# Altium project ASBB.PrjPcb (part 2 of 2)

## Sheet ASBB_ServoIn.SchDoc
size A4
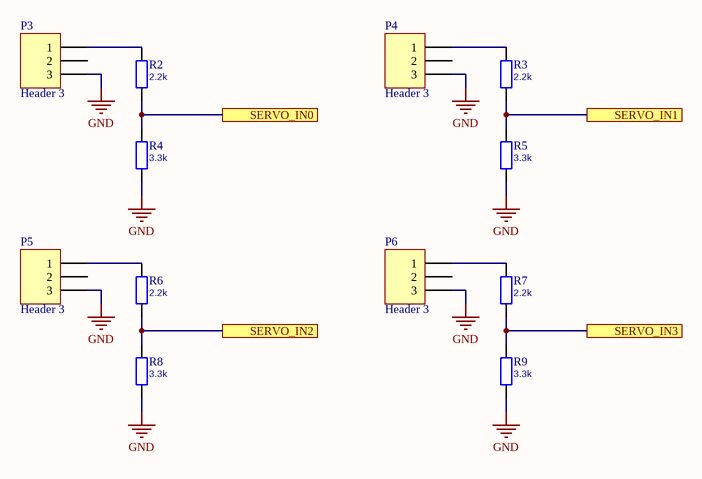
[diagram p18: ASBB_ServoIn.SchDoc]

### Parts
P3  Header 3  [HDR1X3]
P4  Header 3  [HDR1X3]
P5  Header 3  [HDR1X3]
P6  Header 3  [HDR1X3]
R2  2.2k  [0603]
R3  2.2k  [0603]
R4  3.3k  [0603]
R5  3.3k  [0603]
R6  2.2k  [0603]
R7  2.2k  [0603]
R8  3.3k  [0603]
R9  3.3k  [0603]

### Ports
SERVO_IN0, SERVO_IN1, SERVO_IN2, SERVO_IN3

### Nets
GND: P3.3 P4.3 P5.3 P6.3 R4.1 R5.1 R8.1 R9.1
NetIC601_1: R7.1 R9.2 ; port SERVO_IN3
NetIC601_27: R2.1 R4.2 ; port SERVO_IN0
NetIC601_28: R3.1 R5.2 ; port SERVO_IN1
NetIC601_29: R6.1 R8.2 ; port SERVO_IN2
NetP3_1: P3.1 R2.2
NetP4_1: P4.1 R3.2
NetP5_1: P5.1 R6.2
NetP6_1: P6.1 R7.2

Not connected (* = marked no-connect by the designer): P3 2; P4 2; P5 2; P6 2

### Library data of the parts
P3-P6 = Header 3: Header, 3-Pin; LatestRevisionDate: 17-Jul-2002; LatestRevisionNote: Re-released for DXP Platform.; Publisher: Altium Limited
R2-R9 = Resistor: Partnumber: ?; Value: ?

## Nets that join several sheets
3.3V: ASBB_5VBuck (5 pins), ASBB_USBUART (5 pins), ASBB_BMP388 (5 pins), ASBB_BNO055 (5 pins), ASBB_MCP25625 (P801.2 R801.2), ASBB_FireflyX1 (L501.1), ASBB_SX1278 (IC1301.8 IC1301.13), ASBB_GiantGecko (24 pins), ASBB_Servo (12 pins), ASBB_MightyGecko (6 pins), ASBB_Sonar (6 pins), ASBB_WheelSpeed (6 pins), ASBB_ADC (6 pins)
5V: ASBB_5VBuck (9 pins), ASBB_MAX98357 (7 pins), ASBB_MCP25625 (P801.1), ASBB_Servo (12 pins), ASBB_MightyGecko (IC901.37), ASBB_Sonar (6 pins)
GND: ASBB_VarBuck (12 pins), ASBB_5VBuck (18 pins), ASBB_USBUART (12 pins), ASBB_BMP388 (6 pins), ASBB_BNO055 (13 pins), ASBB_MAX98357 (11 pins), ASBB_MCP25625 (P801.8), ASBB_FireflyX1 (13 pins), ASBB_SX1278 (IC1301.1 P1301.6), ASBB_GiantGecko (33 pins), ASBB_Servo (6 pins), ASBB_MightyGecko (9 pins), ASBB_Sonar (6 pins), ASBB_WheelSpeed (P1701.3 P1702.3 P1703.3), ASBB_VIN (C1601.2 D1601.2 Q1601.3), ASBB_ADC (5 pins), ASBB_ServoIn (8 pins)
GG_US0_CLK: ASBB_SX1278 (IC1301.12 P1301.3), ASBB_GiantGecko (IC601.96)
GG_US0_RX: ASBB_SX1278 (IC1301.11 P1301.4), ASBB_GiantGecko (IC601.95)
GG_US0_TX: ASBB_SX1278 (IC1301.10 P1301.5), ASBB_GiantGecko (IC601.94)
HPC_CS0: ASBB_GiantGecko (IC601.15), ASBB_SPICrossbar (J1201.2 P1203.1)
HPC_CS1: ASBB_MightyGecko (IC901.48), ASBB_SPICrossbar (J1201.1 P1203.2)
HPC_MISO: ASBB_GiantGecko (IC601.12), ASBB_SPICrossbar (J1201.4 P1201.1 P1202.3)
HPC_MOSI: ASBB_GiantGecko (IC601.13), ASBB_SPICrossbar (J1201.3 P1201.3 P1202.1)
HPC_SCK: ASBB_GiantGecko (IC601.14), ASBB_MightyGecko (IC901.46), ASBB_SPICrossbar (J1201.5)
NetB501_13: ASBB_FireflyX1 (B501.13 P501.4), ASBB_GiantGecko (IC601.69)
NetB501_19: ASBB_FireflyX1 (B501.19 P501.1 R502.1), ASBB_GiantGecko (IC601.70)
NetC1404_2: ASBB_5VBuck (D201.2), ASBB_USBUART (C1404.2 C1405.2 J1401.1 U1401.19)
NetIC601_1: ASBB_GiantGecko (IC601.1), ASBB_ServoIn (R7.1 R9.2)
NetIC601_9: ASBB_GiantGecko (IC601.9), ASBB_WheelSpeed (P1701.2 R1701.1)
NetIC601_10: ASBB_GiantGecko (IC601.10), ASBB_WheelSpeed (P1702.2 R1702.1)
NetIC601_11: ASBB_GiantGecko (IC601.11), ASBB_WheelSpeed (P1703.2 R1703.1)
NetIC601_18: ASBB_MAX98357 (P701.2 U701.14), ASBB_GiantGecko (IC601.18)
NetIC601_19: ASBB_MAX98357 (P701.1 U701.1), ASBB_GiantGecko (IC601.19)
NetIC601_21: ASBB_MAX98357 (P701.3 U701.16), ASBB_GiantGecko (IC601.21)
NetIC601_22: ASBB_GiantGecko (IC601.22), ASBB_Sonar (R1109.1 R1112.2)
NetIC601_23: ASBB_GiantGecko (IC601.23), ASBB_Sonar (R1107.1 R1110.2)
NetIC601_26: ASBB_GiantGecko (IC601.26), ASBB_Sonar (R1108.1 R1111.2)
NetIC601_27: ASBB_GiantGecko (IC601.27), ASBB_ServoIn (R2.1 R4.2)
NetIC601_28: ASBB_GiantGecko (IC601.28), ASBB_ServoIn (R3.1 R5.2)
NetIC601_29: ASBB_GiantGecko (IC601.29), ASBB_ServoIn (R6.1 R8.2)
NetIC601_54: ASBB_BMP388 (U301.7), ASBB_GiantGecko (IC601.54)
NetIC601_61: ASBB_BNO055 (R403.2 U401.11), ASBB_GiantGecko (IC601.61)
NetIC601_64: ASBB_BMP388 (U301.4), ASBB_BNO055 (U401.20), ASBB_GiantGecko (IC601.64 P601.1 R604.1), ASBB_ADC (U1.6)
NetIC601_65: ASBB_BMP388 (U301.2), ASBB_BNO055 (U401.19), ASBB_GiantGecko (IC601.65 P601.2 R603.1), ASBB_ADC (U1.5)
NetIC601_67: ASBB_GiantGecko (IC601.67), ASBB_Sonar (Q1103.2 R1105.1)
NetIC601_68: ASBB_BNO055 (U401.14), ASBB_GiantGecko (IC601.68)
NetIC601_71: ASBB_SX1278 (IC1301.4 P1301.1), ASBB_GiantGecko (IC601.71)
NetIC601_75: ASBB_FireflyX1 (P501.3 R501.2), ASBB_GiantGecko (IC601.75)
NetIC601_80: ASBB_FireflyX1 (P501.2 R503.2), ASBB_GiantGecko (IC601.80)
NetIC601_84: ASBB_USBUART (U1401.2), ASBB_GiantGecko (IC601.84)
NetIC601_85: ASBB_USBUART (U1401.30), ASBB_GiantGecko (IC601.85)
NetIC601_87: ASBB_SX1278 (IC1301.2 P1301.2), ASBB_GiantGecko (IC601.87)
NetIC601_92: ASBB_GiantGecko (IC601.92), ASBB_Sonar (Q1101.2 R1101.1)
NetIC601_93: ASBB_GiantGecko (IC601.93), ASBB_Sonar (Q1102.2 R1103.1)
NetIC901_4: ASBB_MCP25625 (P801.7), ASBB_MightyGecko (IC901.4)
NetIC901_18: ASBB_MightyGecko (IC901.18), ASBB_SPICrossbar (P1202.2)
NetIC901_19: ASBB_MCP25625 (P801.4), ASBB_MightyGecko (IC901.19)
NetIC901_20: ASBB_MCP25625 (P801.5), ASBB_MightyGecko (IC901.20)
NetIC901_21: ASBB_MCP25625 (P801.3), ASBB_MightyGecko (IC901.21)
NetIC901_28: ASBB_MCP25625 (P802.6), ASBB_MightyGecko (IC901.28)
NetIC901_29: ASBB_MCP25625 (P802.5), ASBB_MightyGecko (IC901.29)
NetIC901_30: ASBB_Servo (Q1006.2 R1011.1), ASBB_MightyGecko (IC901.30)
NetIC901_31: ASBB_Servo (Q1004.2 R1007.1), ASBB_MightyGecko (IC901.31)
NetIC901_32: ASBB_MCP25625 (P801.6 R801.1), ASBB_MightyGecko (IC901.32)
NetIC901_33: ASBB_USBUART (U1401.6), ASBB_MightyGecko (IC901.33)
NetIC901_34: ASBB_USBUART (U1401.5), ASBB_MightyGecko (IC901.34)
NetIC901_44: ASBB_MightyGecko (IC901.44), ASBB_SPICrossbar (P1201.2)
NetIC901_45: ASBB_Servo (Q1001.2 R1001.1), ASBB_MightyGecko (IC901.45)
NetIC901_47: ASBB_Servo (Q1003.2 R1005.1), ASBB_MightyGecko (IC901.47)
NetIC901_49: ASBB_Servo (Q1005.2 R1009.1), ASBB_MightyGecko (IC901.49)
NetIC901_51: ASBB_Servo (Q1002.2 R1003.1), ASBB_MightyGecko (IC901.51)
NetIC901_53: ASBB_MCP25625 (P802.7), ASBB_MightyGecko (IC901.53)
NetIC901_55: ASBB_MCP25625 (P802.8), ASBB_MightyGecko (IC901.55)
NetIC901_57: ASBB_MCP25625 (P802.1), ASBB_MightyGecko (IC901.57)
NetIC901_58: ASBB_MCP25625 (P802.2), ASBB_MightyGecko (IC901.58)
NetIC901_59: ASBB_MCP25625 (P802.3), ASBB_MightyGecko (IC901.59)
NetIC901_60: ASBB_MCP25625 (P802.4), ASBB_MightyGecko (IC901.60)
V_IN: ASBB_VarBuck (5 pins), ASBB_5VBuck (5 pins), ASBB_VIN (J1601.1 R1601.2)